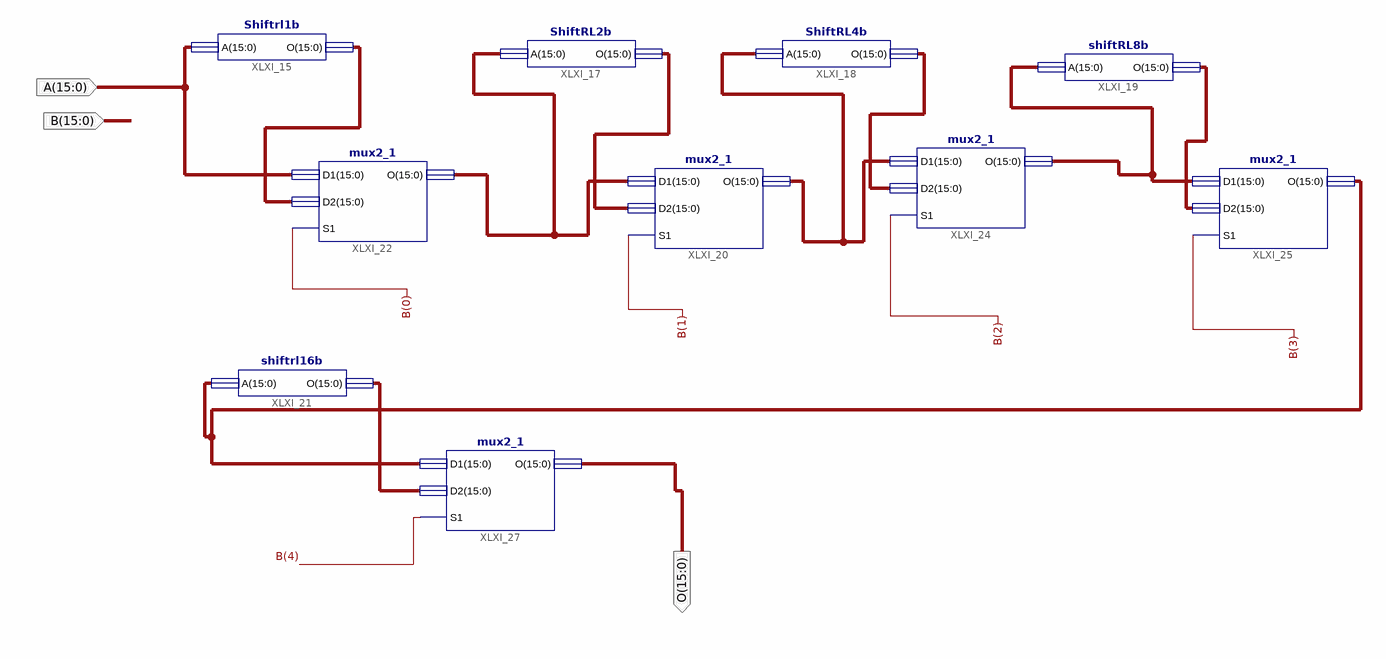
[diagram p0: schematic sheet 1]
// Xilinx ISE schematic ShiftRightL.sch (spartan3e) as structural Verilog: 10 symbols, 3 ports
module ShiftRightL (
  input  [15:0] A,
  input  [15:0] B,
  output [15:0] O
);

  wire [15:0] XLXN_12, XLXN_19, XLXN_23, XLXN_25, XLXN_27, XLXN_28, XLXN_31, XLXN_36, XLXN_38;

  Shiftrl1b XLXI_15 (.A(A), .O(XLXN_19));
  ShiftRL2b XLXI_17 (.A(XLXN_27), .O(XLXN_25));
  ShiftRL4b XLXI_18 (.A(XLXN_23), .O(XLXN_28));
  shiftRL8b XLXI_19 (.A(XLXN_31), .O(XLXN_12));
  shiftrl16b XLXI_21 (.A(XLXN_36), .O(XLXN_38));
  mux2_1 XLXI_22 (.D1(A), .D2(XLXN_19), .S1(B[0]), .O(XLXN_27));
  mux2_1 XLXI_20 (.D1(XLXN_27), .D2(XLXN_25), .S1(B[1]), .O(XLXN_23));
  mux2_1 XLXI_24 (.D1(XLXN_23), .D2(XLXN_28), .S1(B[2]), .O(XLXN_31));
  mux2_1 XLXI_25 (.D1(XLXN_31), .D2(XLXN_12), .S1(B[3]), .O(XLXN_36));
  mux2_1 XLXI_27 (.D1(XLXN_36), .D2(XLXN_38), .S1(B[4]), .O(O));
endmodule
